# EAGLE board dw08aRev2 (EAGLE 6.6.0), part 1 of 3
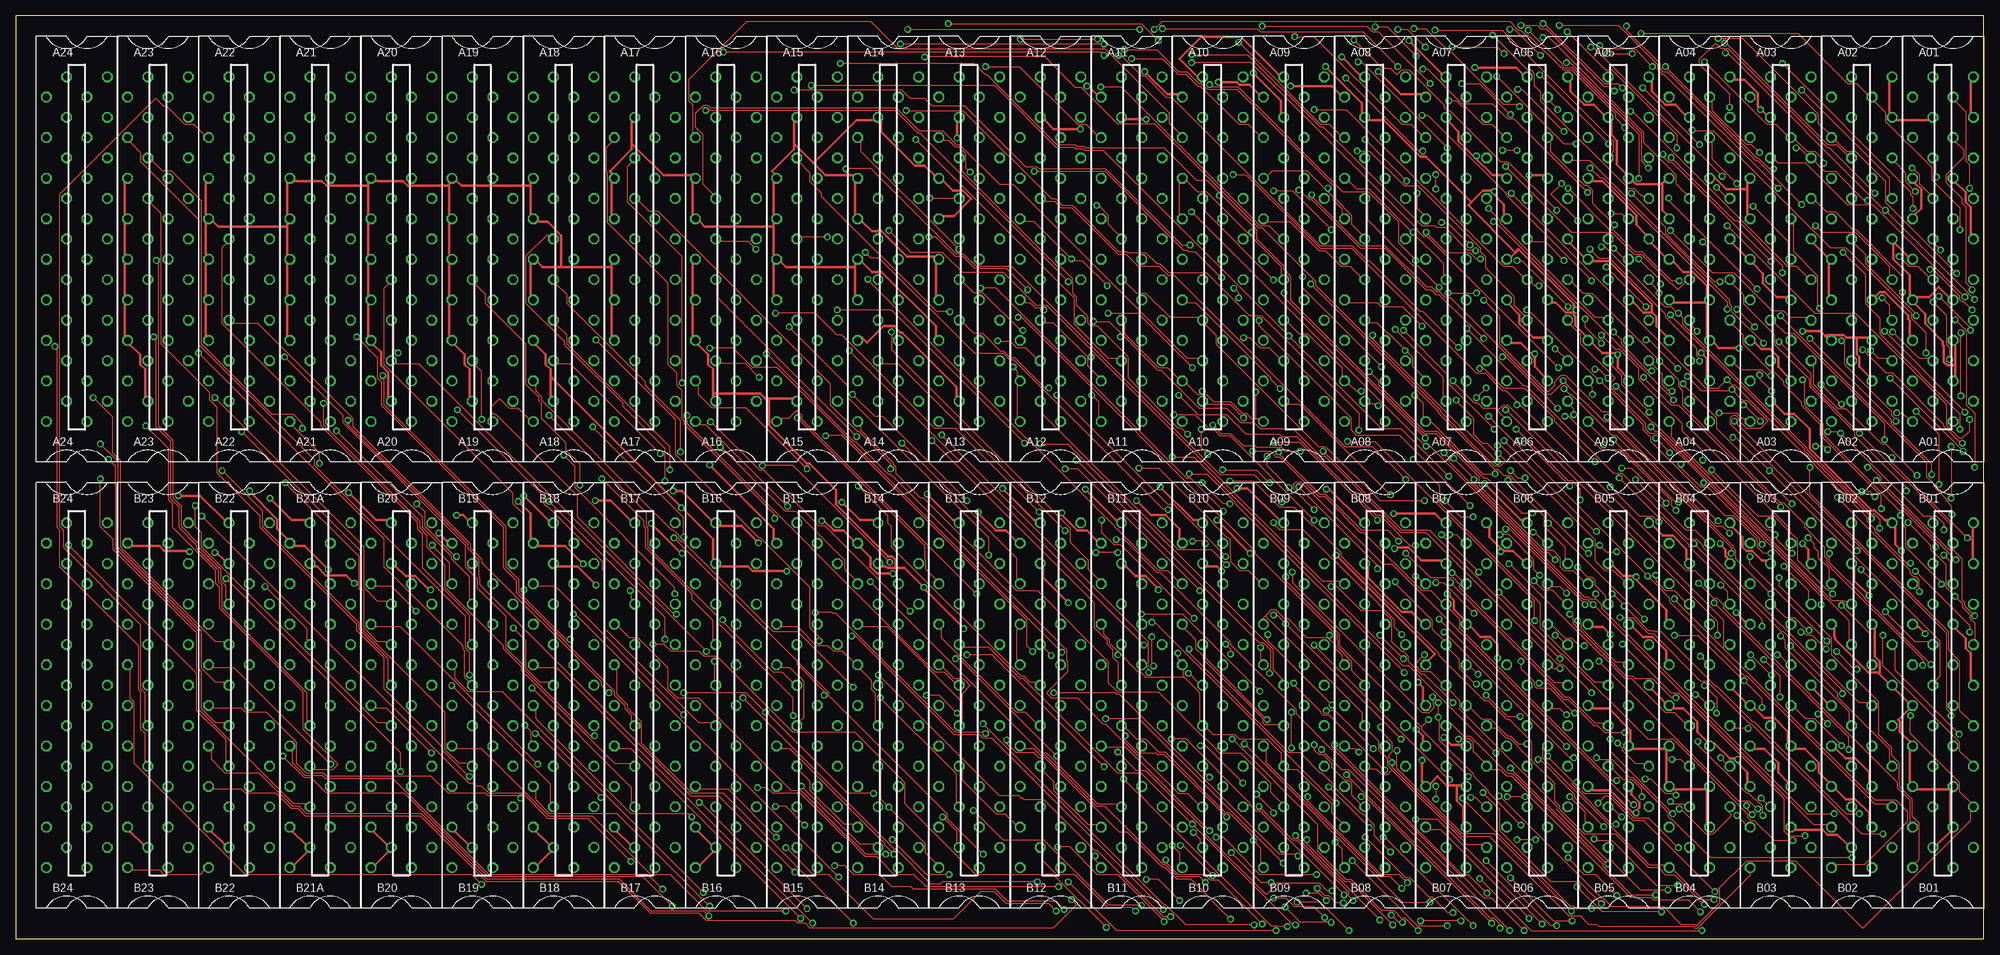
[diagram p6: board, top side]
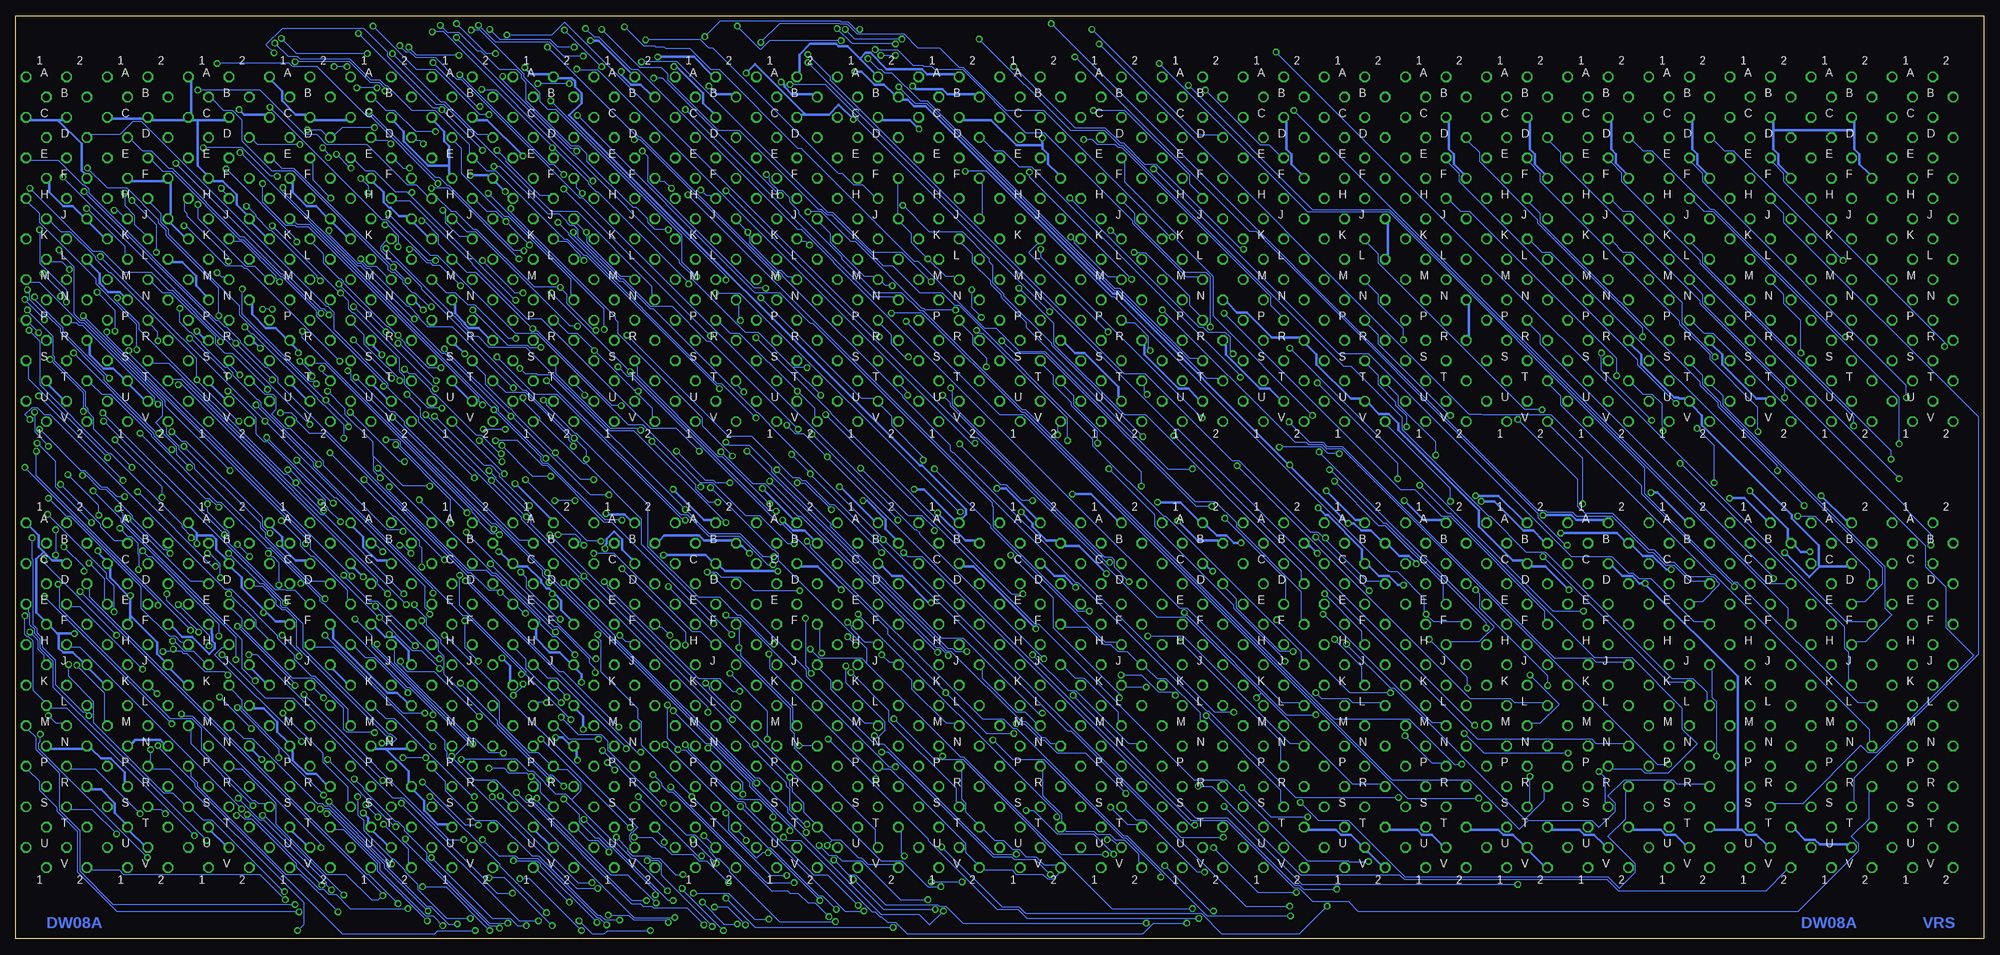
[diagram p7: board, bottom side, seen from below]

Size 307.98 x 144.46 mm. Coordinates in mm from the lower left corner, seen from the top.
Outline: 0,0 307.98,0 307.98,144.46 0,144.46 0,0
Copper layers (1*16): Top 0.035mm / dielectric 1.5mm / Bottom 0.035mm
Design rules "sierraproto": minimum track width 6mil, minimum drill 24mil, track to track 6mil, track to pad 6mil, pad to pad 10mil, via to via 6mil, smd to smd 6mil, copper to edge 25mil, drill to drill 10mil, minimum pad ring 10mil, minimum via ring 8mil, stop-mask expansion 0mil, vias tented up to drill 0mil, thermal gap 10mil
Net classes: 1 supply: width 0.381 mm

## Footprints (pad centres in the part's own frame; a part is rotated, then mirrored left to right if it is on the bottom)
H807 = drill 1.092 octagon: A1 4.763,28.575; A2 -1.587,28.575; B1 1.587,25.4; B2 -4.763,25.4; C1 4.763,22.225; C2 -1.587,22.225; D1 1.587,19.05; D2 -4.763,19.05; E1 4.763,15.875; E2 -1.587,15.875; F1 1.587,12.7; F2 -4.763,12.7; H1 4.763,9.525; H2 -1.587,9.525; J1 1.587,6.35; J2 -4.763,6.35; K1 4.763,3.175; K2 -1.587,3.175; L1 1.587,0; L2 -4.763,0; M1 4.763,-3.175; M2 -1.587,-3.175; N1 1.587,-6.35; N2 -4.763,-6.35; P1 4.763,-9.525; P2 -1.587,-9.525; R1 1.587,-12.7; R2 -4.763,-12.7; S1 4.763,-15.875; S2 -1.587,-15.875; T1 1.587,-19.05; T2 -4.763,-19.05; U1 4.763,-22.225; U2 -1.587,-22.225; V1 1.587,-25.4; V2 -4.763,-25.4

## Placement (x,y rotation side)
A01  M903  [H807]  301.62,106.36 0 top
A02  M903  [H807]  288.93,106.36 0 top
A03  M903  [H807]  276.23,106.36 0 top
A04  M903  [H807]  263.52,106.36 0 top
A05  M903  [H807]  250.82,106.36 0 top
A06  M907  [H807]  238.12,106.36 0 top
A07  M651  [H807]  225.43,106.36 0 top
A08  M651  [H807]  212.72,106.36 0 top
A09  M651  [H807]  200.03,106.36 0 top
A10  M651  [H807]  187.32,106.36 0 top
A11  M651  [H807]  174.62,106.36 0 top
A12  M651  [H807]  161.93,106.36 0 top
A13  W011  [H807]  149.22,106.36 0 top
A14  W011  [H807]  136.53,106.36 0 top
A15  W011  [H807]  123.83,106.36 0 top
A16  W011  [H807]  111.12,106.36 0 top
A17  W011  [H807]  98.42,106.36 0 top
A18  W011  [H807]  85.72,106.36 0 top
A19  W011  [H807]  73.03,106.36 0 top
A20  W011  [H807]  60.33,106.36 0 top
A21  W011  [H807]  47.62,106.36 0 top
A22  W011  [H807]  34.92,106.36 0 top
A23  W011  [H807]  22.23,106.36 0 top
A24  H807  [H807]  9.53,106.36 0 top
B01  M903  [H807]  301.62,36.51 0 top
B02  M903  [H807]  288.93,36.51 0 top
B03  M903  [H807]  276.23,36.51 0 top
B04  M903  [H807]  263.52,36.51 0 top
B05  M903  [H807]  250.82,36.51 0 top
B06  M101  [H807]  238.12,36.51 0 top
B07  M907  [H807]  225.43,36.51 0 top
B08  M651  [H807]  212.72,36.51 0 top
B09  M651  [H807]  200.03,36.51 0 top
B10  M651  [H807]  187.32,36.51 0 top
B11  M651  [H807]  174.62,36.51 0 top
B12  M651  [H807]  161.93,36.51 0 top
B13  M651  [H807]  149.22,36.51 0 top
B14  M651  [H807]  136.53,36.51 0 top
B15  M651  [H807]  123.83,36.51 0 top
B16  M517  [H807]  111.12,36.51 0 top
B17  M517  [H807]  98.42,36.51 0 top
B18  M517  [H807]  85.72,36.51 0 top
B19  M517  [H807]  73.03,36.51 0 top
B20  M517  [H807]  60.33,36.51 0 top
B21A  M517  [H807]  47.62,36.51 0 top
B22  M517  [H807]  34.92,36.51 0 top
B23  M517  [H807]  22.23,36.51 0 top
B24  H807  [H807]  9.53,36.51 0 top

## Tracks (layer width: path | path; a pad name or v marks a point on that pad's centre or on a via)
!I_MB03  (via drill 0.61)
  Top 0.152: v222.76,101.98 219.33,105.41 218.69,105.41 211.58,112.52 211.58,115.19 A08.H2 | v304.17,32 294.13,42.04 294.13,45.34 B02.H1 | v287.4,12.7 265.18,12.7 259.08,18.8 258.95,18.8 258.57,19.18 258.57,19.81 253.11,25.27 252.6,25.27 249.81,28.07 247.65,28.07 v247.4,28.32 | v243.84,28.32 243.21,28.32 v223.52,48.01 | v244.86,68.71 244.86,70.36 243.59,71.63 242.95,71.63 v234.82,79.76 | v231.39,79.76 224.16,87 224.16,88.27 v217.17,95.25 | v279.53,132.84 293.24,119.13 293.24,116.59 A02.H1
  Bottom 0.152: v304.17,32 304.17,30.86 304.42,30.61 304.42,29.72 v287.4,12.7 | v243.84,28.32 v247.4,28.32 | v223.52,48.01 223.65,48.01 232.79,57.15 233.3,57.15 v244.86,68.71 | v234.82,79.76 v231.39,79.76 | v217.17,95.25 217.55,95.25 221.74,99.44 221.74,100.84 222.5,101.6 v222.76,101.98 226.82,101.98 235.84,111 236.35,111 239.14,113.79 239.78,113.79 242.19,116.2 A06.H1 243.59,116.33 245.24,117.98 246.63,117.98 252.98,124.33 259.33,124.33 260.86,125.86 262.76,125.86 269.75,132.84 v279.53,132.84
!I_MB04  (via drill 0.61)
  Top 0.152: v213.23,83.44 212.98,83.69 211.84,83.69 A08.U2 | v227.08,95.5 235.97,86.61 236.35,86.61 250.06,72.9 251.33,72.9 261.62,62.61 263.02,62.61 264.03,61.59 264.03,61.34 288.42,36.96 289.81,36.96 B02.L1 | v296.93,114.3 296.93,116.2 296.55,116.59 296.55,116.97 v276.48,137.03 | v241.94,118.24 240.28,116.59 v244.47,112.39
  Bottom 0.152: v213.23,83.44 214.63,83.44 226.31,95.12 226.82,95.12 227.2,95.5 | 227.2,95.5 235.97,104.27 237.36,104.27 239.01,105.92 A06.L1 240.16,107.06 241.81,108.71 241.81,110.11 244.09,112.39 v244.47,112.39 | 227.2,95.5 v227.08,95.5 | v296.93,114.3 296.8,114.3 290.96,108.46 290.96,107.06 A02.L1 | v276.48,137.03 265.18,137.03 264.67,136.53 260.86,136.53 253.11,128.78 252.48,128.78 v241.94,118.24
!I_MB05  (via drill 0.61)
  Top 0.152: v277.75,45.85 285.12,38.48 285.12,37.85 293.24,29.72 293.24,27.69 B02.P1 | v282.57,52.32 282.57,53.59 264.16,72.01 | 264.16,72.01 257.05,79.12 255.78,79.12 255.14,79.76 255.14,80.64 249.68,86.11 249.68,87.12 250.32,87.76 244.98,93.09 244.98,94.49 243.33,96.14 A06.P1 | v292.1,100.33 293.24,99.19 293.24,97.54 A02.P1 | v264.16,71.37 264.16,72.01 | v194.56,96.77 194.56,96.01 209.04,81.53 209.04,79.63 209.8,78.87 216.53,78.87 v227.58,67.82 | v242.44,81.79 242.95,81.79 248.16,76.58 251.08,76.58 259.08,68.58 259.08,67.82 v259.84,67.06
  Bottom 0.152: v277.75,45.85 277.75,47.5 v282.57,52.32 | v292.1,100.33 292.1,99.69 288.67,96.27 288.67,95.38 265.94,72.64 265.43,72.64 v264.16,71.37 264.03,70.99 260.1,67.06 v259.84,67.06 | v194.56,96.77 194.82,97.03 194.82,99.31 A09.N2 | v227.58,67.82 227.71,67.82 232.28,72.39 232.28,72.77 233.55,74.04 234.7,74.04 v242.44,81.79
!I_MB06  (via drill 0.61)
  Top 0.152: v196.85,103.12 186.18,113.79 186.18,115.19 A10.H2 | v224.28,131.19 225.43,131.19 226.31,130.3 226.82,130.3 229.62,127.51 231.01,127.51 232.66,125.86 A06.D2 | v280.54,62.74 281.43,61.85 281.43,61.34 282.07,60.71 282.07,59.69 283.72,58.04 283.72,56.26 B02.D2 | v305.94,95.25 305.94,95.63 v300.99,100.58 | v303.78,104.14 292.61,115.32 292.61,118.62 287.91,123.32 286.51,123.32 284.86,124.97 A02.D2 283.72,126.11 282.07,127.76 282.07,129.16 270.26,140.97 v266.45,140.97 | v249.05,138.56 v252.98,138.56
  Bottom 0.152: v196.85,103.12 196.85,103.76 v224.28,131.19 | v280.54,62.74 280.54,62.99 282.07,64.52 282.07,64.9 293.24,76.07 293.62,76.07 304.29,86.74 304.29,93.6 v305.94,95.25 | v300.99,100.58 300.99,101.35 v303.78,104.14 | v249.05,138.56 241.43,130.94 240.79,130.94 235.71,125.86 234.06,125.86 A06.D2 | v252.98,138.56 264.03,138.56 v266.45,140.97
!I_MB07  (via drill 0.61)
  Top 0.152: v192.15,81.53 189.99,83.69 186.44,83.69 A10.U2 | v223.14,112.14 224.03,112.14 v227.58,108.58 | v255.91,80.14 256.54,79.5 257.18,79.5 286.89,49.78 286.89,46.74 B02.H2 | v231.27,112.27 231.52,112.27 v259.46,84.33
  Bottom 0.152: v192.15,81.53 197.49,86.87 198.12,86.87 221.49,110.24 221.49,110.49 v223.14,112.14 | v227.58,108.58 v231.27,112.27 232.79,113.79 234.19,113.79 235.84,115.44 A06.H2 | v255.91,80.14 255.91,80.64 259.59,84.33 | 259.59,84.33 272.92,97.66 272.92,99.06 284.1,110.24 284.1,111 285.24,112.14 285.24,113.54 286.89,115.19 A02.H2 | v259.46,84.33 259.59,84.33
!I_MB08  (via drill 0.61)
  Top 0.152: v276.23,47.37 276.86,46.74 276.86,45.59 286.89,35.56 286.89,34.04 B02.M2 | v288.16,60.71 268.22,80.64 268.22,81.41 268.73,81.92 269.24,81.92 269.75,81.41 269.75,81.03 270.89,79.88 273.05,79.88 274.19,81.03 270.89,84.33 270.26,84.33 v268.61,85.98 268.22,85.85 263.78,85.85 v261.62,88.01 | v203.2,129.79 208.28,129.79 232.79,105.28 234.19,105.28 235.84,103.63 A06.M2 237.24,102.74 237.74,102.23 v238.38,102.23 | v263.52,90.42 263.52,90.81 263.02,91.31 263.02,92.46 258.19,97.28 258.19,97.79 249.43,106.55 247.78,106.55 v246.38,107.95
  Bottom 0.152: v276.23,47.37 276.23,49.28 286.77,59.82 287.27,59.82 v288.16,60.71 | v268.61,85.98 268.61,86.11 274.07,91.57 275.21,91.57 276.73,93.09 276.73,94.23 283.59,101.09 284.99,101.09 286.64,102.74 A02.M2 | v203.2,129.79 173.86,100.46 170.56,100.46 A11.N2 | v261.62,88.01 261.62,88.52 v263.52,90.42 | v246.38,107.95 245.75,107.95 243.59,105.79 243.08,105.79 242.7,105.41 241.55,105.41 v238.38,102.23
!O_MB03  (via drill 0.61)
  Top 0.152: v127,109.86 122.94,109.86 A15.K2 | v191.39,140.34 204.22,127.51 205.61,127.51 207.26,125.86 A08.D2
  Bottom 0.152: v127,109.86 127.25,109.86 147.07,129.67 152.91,129.67 159.64,136.4 160.27,136.4 163.32,139.45 166.75,139.45 168.91,141.6 176.28,141.6 177.8,143.13 178.94,143.13 179.07,143.26 188.47,143.26 v191.39,140.34
!O_MB04  (via drill 0.61)
  Top 0.152: v189.99,68.07 188.98,68.07 v185.67,71.37 | v180.34,67.18 179.58,67.18 156.21,90.55 155.57,90.55 154.56,91.57 150.11,91.57 135.13,106.55 133.86,106.55 v132.97,107.44
  Bottom 0.152: v189.99,68.07 197.36,75.44 197.99,75.44 210.69,88.14 210.69,89.79 A08.S2 | v185.67,71.37 184.53,71.37 v180.34,67.18 | v132.97,107.44 131.19,107.44 124.33,100.58 124.33,99.19 122.68,97.54 A15.P2
!O_MB05  (via drill 0.61)
  Top 0.152: v169.8,133.35 172.97,133.35 194.69,111.63 196.09,111.63 197.74,109.98 A09.K2
  Bottom 0.152: v169.8,133.35 167.26,130.81 165.48,130.81 136.14,101.47 135.38,101.47 121.67,87.76 119.76,87.76 A15.T2
!O_MB06
  Top 0.152: A16.D2 105.92,126.11 105.92,130.56 105.28,131.19 105.28,134.49 114.43,143.64 133.73,143.64 138.05,139.32 170.43,139.32 180.47,129.29 180.47,127.76 182.12,126.11 A10.D2
!O_MB07
  Top 0.152: A10.S2 185.04,90.93 183.26,90.93 156.08,118.11 153.92,118.11 147.7,124.33 147.19,124.33 145.03,126.49 141.35,126.49 137.79,130.05 108.71,130.05 108.33,130.43 107.57,130.43 106.3,129.16 106.3,127.13 107.44,125.98 107.44,118.24 109.09,116.59 A16.H2
!O_MB08  (via drill 0.61)
  Top 0.152: v131.57,78.61 109.98,100.2 109.98,102.49 A16.M2 | v169.16,114.81 169.42,114.81 170.94,113.28 170.94,111.89 172.59,110.24 A11.K2
  Bottom 0.152: v131.57,78.61 145.92,92.96 145.92,93.22 153.42,100.71 153.42,100.97 155.07,102.62 155.07,105.41 155.57,105.92 155.57,106.43 159.77,110.62 164.97,110.62 v169.16,114.81
-15V  (via drill 0.61)
  Top 0.381: v126.11,65.41 126.49,65.41 128.02,63.88 129.54,63.88 131.06,62.36 B14.B2 132.21,61.21 133.73,59.69 133.73,58.17 134.75,57.15 v137.29,57.15 | v163.7,66.67 163.7,66.29 166.12,63.88 167.64,63.88 169.16,62.36 B11.B2 | v175.39,68.58 177.67,66.29 179.96,66.29 182.12,64.14 182.12,62.61 B10.B2 | v193.17,60.33 v187.96,65.53 | v150.62,66.8 150.62,66.67 153.42,63.88 154.94,63.88 156.46,62.36 B12.B2 | v167.64,133.48 167.89,133.48 169.16,132.21 A11.B2 | v176.66,135.76 180.21,132.21 181.86,132.21 A10.B2 | v199.52,133.48 205.99,133.48 207.26,132.21 A08.B2 | v213.23,135.76 216.79,132.21 219.96,132.21 A07.B2 | v188.21,134.11 191.13,134.11 191.52,133.73 193.04,133.73 194.56,132.21 A09.B2 | v88.77,58.67 85.98,61.47 81.66,61.47 B18.B2 80.52,62.61 80.52,66.55 v78.61,68.45 | v104.27,60.33 104.14,60.33 v99.44,65.02 | v27.18,60.58 27.05,60.71 23.24,60.71 22.48,61.47 18.16,61.47 B23.B2 | v48.9,57.78 45.21,61.47 43.56,61.47 B21A.B2 42.42,62.61 40.89,64.14 40.89,65.66 36.58,69.98 v36.58,70.1 | v66.17,63.5 67.31,62.36 67.56,62.36 B19.B2 | v108.58,74.17 118.62,64.14 118.62,62.61 B15.B2
  Bottom 0.381: v126.11,65.41 123.06,62.36 119.76,62.36 B15.B2 | v137.29,57.15 141.6,61.47 143.76,61.47 B13.B2 145.16,62.36 146.69,62.36 148.84,64.52 148.84,65.02 v150.62,66.8 | B08.B2 207.26,62.36 206.5,63.12 201.04,63.12 200.28,62.36 195.96,62.36 B09.B2 194.56,61.47 194.31,61.47 v193.17,60.33 | v163.7,66.67 159.38,62.36 157.86,62.36 B12.B2 | v175.39,68.58 174.75,68.58 171.83,65.66 171.83,64.14 170.31,62.61 B11.B2 | v187.96,65.53 186.31,63.88 184.53,63.88 B10.B2 | v167.64,133.48 167.13,132.97 162.94,132.97 162.18,132.21 157.86,132.21 A12.B2 | v176.66,135.76 175.64,135.76 173.61,133.73 172.09,133.73 170.56,132.21 A11.B2 169.16,131.32 168.4,131.32 167.39,130.3 165.61,130.3 136.27,100.97 135.51,100.97 108.65,74.11 | v199.52,133.48 198.25,132.21 195.96,132.21 A09.B2 | v213.23,135.76 213.23,135.25 211.71,133.73 210.19,133.73 208.66,132.21 A08.B2 | v188.21,134.11 187.71,133.6 187.71,133.35 186.56,132.21 183.26,132.21 A10.B2 | v88.77,58.67 88.77,58.8 89.92,59.94 91.44,59.94 92.96,61.47 B17.B2 94.36,62.36 95.89,63.88 97.41,63.88 98.55,65.02 v99.44,65.02 99.82,65.28 108.65,74.11 | v104.27,60.33 105.41,61.47 105.66,61.47 B16.B2 | v27.18,60.58 28.57,60.58 29.46,61.47 B22.B2 30.61,62.61 30.61,64.14 v36.58,70.1 | v48.9,57.78 49.66,57.78 51.82,59.94 53.34,59.94 54.86,61.47 B20.B2 56.26,62.36 57.4,63.5 v66.17,63.5 | v78.61,68.45 76.58,68.45 72.01,63.88 70.48,63.88 68.96,62.36 B19.B2 | v108.58,74.17 108.65,74.11
A06U1  (via drill 0.61)
  Top 0.152: 205.1,117.22 202.18,120.14 196.6,120.14 195.96,119.51 A09.F2 | 205.1,117.22 206.12,116.2 206.12,115.7 207.52,114.3 207.52,113.41 A08.J2 | v205.36,117.47 205.1,117.22 | 218.69,110.49 211.84,117.35 209.93,117.35 208.66,118.62 A08.F2 | 218.69,110.49 223.39,105.79 223.39,103.89 A07.M2 | v219.33,116.71 219.33,114.3 220.22,113.41 A07.J2 | A09.J2 195.96,112.27 199.39,112.27 203.96,107.7 204.98,107.7 207.39,105.28 208.79,105.28 210.44,103.63 A08.M2 | v218.69,110.62 218.69,110.49 | v233.55,71.75 239.14,66.17 239.14,64.64 242.44,61.34 242.44,59.44 B06.C1 | v243.84,82.04 243.84,82.93 243.33,83.44 A06.U1 | A12.J2 157.86,112.27 159.38,112.27 v165.23,106.43 165.61,106.17 166.88,106.17 v170.81,102.23 | A11.M2 173.74,102.74 175.39,101.09 176.78,101.09 180.59,97.28 185.04,97.28 A10.P2 186.18,96.14 187.83,94.49 187.83,93.09 203.84,77.09 204.98,77.09 213.49,68.58 v220.47,68.58 | A10.J2 182.12,113.41 182.12,118.36 A10.F2 183.26,118.62 184.91,116.97 186.31,116.97 193.04,110.24 | 193.04,110.24 197.99,105.28 197.99,103.89 A09.M2 | v228.09,66.04 226.19,66.04 v223.65,68.58 | 193.04,110.24 v193.42,110.62
  Bottom 0.152: v205.36,117.47 206.5,118.62 207.26,118.62 A08.F2 | A10.M2 186.44,103.63 187.2,103.63 188.21,104.65 188.85,104.65 193.17,108.97 193.17,110.36 v193.42,110.62 194.82,112.01 A09.J2 | 218.82,110.62 220.22,112.01 A07.J2 | 218.82,110.62 218.57,110.36 218.57,108.97 213.23,103.63 211.84,103.63 A08.M2 | v219.33,116.71 220.22,117.6 220.22,118.36 A07.F2 | 218.82,110.62 v218.69,110.62 | v243.84,82.04 v233.55,71.75 233.3,71.37 233.3,71.25 v228.09,66.04 | A12.J2 156.72,113.41 156.72,118.36 A12.F2 | A12.M2 161.04,103.63 162.43,103.63 v165.23,106.43 167.77,108.97 167.77,110.36 169.42,112.01 A11.J2 169.93,113.41 169.93,118.36 A11.F2 | A10.J2 182.12,112.01 180.47,110.36 180.47,108.97 175.13,103.63 173.74,103.63 A11.M2 172.34,102.74 171.83,102.23 v170.81,102.23 | v220.47,68.58 v223.65,68.58
A06V1  (via drill 0.61)
  Top 0.152: v218.95,85.09 220.22,83.82 220.22,81.66 A07.V2 221.36,81.03 229.62,72.77 v231.52,72.77 | 217.42,92.2 218.57,91.06 218.57,89.66 220.22,88.01 A07.T2 | 217.42,92.2 214.88,94.74 214.76,94.74 213.11,96.39 211.84,96.39 A08.P2 | v217.42,92.08 217.42,92.2 | A09.P2 199.14,96.39 200.79,94.74 202.18,94.74 207.52,89.41 207.52,88.01 A08.T2 208.66,86.87 209.8,85.72 v210.57,85.72 | A12.V2 156.72,81.66 156.72,86.61 A12.T2 156.72,88.01 156.72,88.9 v156.08,89.53 | v168.4,85.09 169.42,84.07 169.42,81.66 A11.V2 | 167.77,91.06 162.43,96.39 161.04,96.39 A12.P2 | 167.77,91.06 167.77,89.66 169.42,88.01 A11.T2 | 194.06,81.41 193.42,81.41 192.53,82.3 191.9,82.3 190.12,84.07 187.45,84.07 186.31,85.22 185.67,85.22 | 194.06,81.41 194.56,81.41 A09.V2 | 185.67,85.22 184.91,85.22 183.26,86.87 A10.T2 181.86,87.76 180.21,89.41 178.82,89.41 173.48,94.74 173.48,96.14 A11.P2 | 194.06,81.41 v194.06,85.6 | 167.77,91.06 v168.28,91.06 | 185.67,85.22 v185.67,85.72
  Bottom 0.152: 210.82,85.47 v217.42,92.08 220.09,94.74 221.49,94.74 223.14,96.39 A07.P2 | 210.82,85.47 208.41,83.06 208.41,81.66 A08.V2 | v218.95,85.09 218.95,85.34 220.22,86.61 A07.T2 | v231.52,72.77 A06.V1 | A10.V2 183.01,81.66 183.01,83.06 v185.67,85.72 194.69,94.74 196.09,94.74 197.74,96.39 A09.P2 | v168.4,85.09 168.4,85.6 169.42,86.61 A11.T2 | v156.08,89.53 156.08,90.93 158.24,93.09 158.24,94.49 159.89,96.14 A12.P2 | v194.06,85.6 194.82,86.36 194.82,86.61 A09.T2 | v168.28,91.06 168.91,91.06 170.94,93.09 170.94,94.49 172.59,96.14 A11.P2 | v210.57,85.72 210.82,85.47
B07U1  (via drill 0.61)
  Top 0.152: B14.M2 134.49,34.04 134.49,38.48 133.86,39.12 133.86,40.51 132.21,42.16 B14.J2 131.06,43.31 129.41,44.96 128.02,44.96 127.13,45.85 125.35,45.85 122.43,48.77 119.76,48.77 B15.F2 | B15.J2 119.76,42.42 121.16,42.42 123.32,40.26 123.32,34.67 122.68,34.04 B15.M2 | B12.J2 156.72,43.56 156.72,48.51 B12.F2 | 148.08,37.08 148.08,38.35 149.35,39.62 148.21,40.77 146.81,40.77 145.16,42.42 B13.J2 | 148.08,37.08 148.08,34.04 B13.M2 | 148.08,37.08 136.4,48.77 132.46,48.77 B14.F2 | 215.39,26.42 214.63,25.65 213.87,25.65 212.98,26.54 211.84,26.54 B08.P2 | 215.39,26.42 214.63,27.18 214.63,28.19 213.23,29.59 213.23,30.99 211.58,32.64 B08.M2 210.69,34.04 210.69,35.43 195.58,50.55 | 215.39,26.42 227.08,14.73 229.49,14.73 B07.U1 | B09.M2 197.74,33.53 195.45,33.53 195.07,33.91 195.07,34.54 185.8,43.81 185.8,44.32 184.66,45.47 184.66,46.86 183.01,48.51 B10.F2 | v206.5,15.11 207.52,14.1 207.52,11.81 B08.V2 | B08.T2 207.52,18.16 205.87,19.81 205.87,21.21 200.53,26.54 199.14,26.54 B09.P2 197.99,27.69 197.99,29.08 195.83,31.24 191.52,31.24 190.75,32 187.32,32 186.44,32.89 B10.M2 185.29,34.04 185.29,38.48 182.88,40.89 | v194.82,45.59 194.82,43.56 B09.J2 | 205.23,47.12 202.06,47.12 199.14,50.04 198.63,50.04 197.23,51.44 196.47,51.44 195.58,50.55 | 205.23,47.12 205.36,47.12 206.5,45.97 206.5,45.47 207.52,44.45 207.52,43.56 B08.J2 | 195.58,50.55 194.94,49.91 B09.F2 | v205.61,47.5 205.23,47.12 | B09.V2 194.82,11.81 194.82,14.22 v193.68,15.37 193.42,15.75 193.42,16.26 189.87,19.81 189.23,19.81 179.83,29.21 178.82,29.21 176.78,31.24 175.39,31.24 173.74,32.89 B11.M2
  Top 0.152: 182.88,40.89 182.75,41.02 182.75,42.16 B10.J2 182.12,43.56 181.86,43.81 v181.86,44.7 | 172.72,44.7 175.64,41.78 176.02,41.78 176.91,40.89 182.88,40.89 | 172.72,44.7 171.2,46.23 171.2,46.74 170.31,47.62 170.31,48.51 B11.F2 | 172.72,44.7 v172.47,44.45 | B13.F2 144.91,48.51 144.91,47.12 156.59,35.43 157.99,35.43 159.64,33.78 B12.M2
  Bottom 0.152: B15.M2 122.68,34.04 122.68,35.43 128.02,40.77 129.41,40.77 131.06,42.42 B14.J2 132.46,43.31 134.11,44.96 135.51,44.96 136.65,46.1 137.67,46.1 140.34,48.77 143.76,48.77 B13.F2 | B12.J2 156.72,42.16 156.72,40.77 151.38,35.43 149.99,35.43 148.34,33.78 B13.M2 | B14.M2 135.38,34.04 135.38,35.43 140.72,40.77 142.11,40.77 143.76,42.42 B13.J2 | v206.5,15.11 206.5,15.75 207.52,16.76 B08.T2 | B09.F2 194.82,48.51 v194.82,45.59 194.56,45.21 194.56,44.32 186.44,36.2 186.44,34.29 186.18,34.04 B10.M2 | v205.61,47.5 206.88,48.77 207.26,48.77 B08.F2 | B12.M2 161.04,33.78 162.43,33.78 167.77,39.12 167.77,40.51 169.42,42.16 B11.J2 170.56,43.31 171.32,43.31 v172.47,44.45 | v193.68,15.37 193.68,15.62 194.82,16.76 B09.T2 | B11.M2 173.74,33.78 175.13,33.78 180.47,39.12 180.47,40.51 182.12,42.16 B10.J2 | v181.86,44.7 182.12,44.96 182.12,48.51 B10.F2
B07V1  (via drill 0.61)
  Top 0.152: B14.T2 131.06,17.91 129.67,17.91 124.33,23.24 124.33,24.64 122.68,26.29 B15.P2 | B14.P2 135.38,26.29 135.38,21.84 v136.65,20.57 142.37,14.86 142.37,13.46 144.02,11.81 B13.V2 | B11.T2 169.16,17.91 167.77,17.91 162.43,23.24 162.43,24.64 160.78,26.29 B12.P2 | B13.P2 148.08,26.29 148.08,24.89 153.42,19.56 154.81,19.56 156.46,17.91 B12.T2 | v180.97,14.61 182.12,13.46 182.12,11.81 B10.V2 | v186.82,25.27 186.18,25.91 186.18,26.29 B10.P2 | v221.36,5.71 217.04,5.71 v192.28,30.48 | v168.91,12.95 168.91,12.32 169.42,11.81 B11.V2
  Bottom 0.152: B14.V2 132.21,11.81 132.21,13.21 134.37,15.37 135.76,15.37 136.65,16.26 138.68,16.26 139.19,16.76 143.51,16.76 143.76,17.02 B13.T2 144.27,18.16 144.27,19.43 147.19,22.35 147.19,26.29 B13.P2 | B12.P2 159.89,26.29 159.89,21.84 159.26,21.21 159.26,19.81 157.61,18.16 B12.T2 156.46,17.02 154.81,15.37 153.42,15.37 152.02,13.97 151,13.97 149.86,12.83 148.34,12.83 147.07,11.56 145.16,11.56 B13.V2 144.53,10.41 145.67,9.27 146.43,9.27 147.19,10.03 151.38,10.03 152.02,10.67 156.46,10.67 B12.V2 157.61,11.81 159.26,13.46 159.26,14.86 169.29,24.89 169.42,24.89 171.07,26.54 172.34,26.54 B11.P2 | v136.65,20.57 133.99,17.91 132.46,17.91 B14.T2 | 180.21,15.37 178.82,15.37 176.02,12.57 175.51,12.57 174.5,11.56 170.56,11.56 B11.V2 | 180.21,15.37 181.86,17.02 B10.T2 183.01,18.16 184.66,19.81 184.66,21.21 186.44,22.99 186.44,23.5 186.82,23.88 v186.82,25.27 187.2,25.53 192.15,30.48 v192.28,30.48 | 180.21,15.37 v180.97,14.61 | v221.36,5.71 226.31,10.67 B07.V1 | v168.91,12.95 169.42,13.46 169.42,16.76 B11.T2
GND  (via drill 0.61)
  Top 0.381: B16.V2 107.06,11.56 109.09,13.59 B16.U2 108.84,14.73 106.81,16.76 B16.T2 | B17.T2 94.11,16.76 96.14,14.73 B17.U2 | B18.V2 81.66,11.56 83.69,13.59 B18.U2 83.44,14.73 81.41,16.76 B18.T2 | B19.T2 68.71,16.76 70.74,14.73 B19.U2 | B20.V2 56.26,11.56 58.29,13.59 B20.U2 58.04,14.73 56.01,16.76 B20.T2 | B21A.V2 43.56,11.56 45.59,13.59 B21A.U2 45.34,14.73 43.31,16.76 B21A.T2 | B23.U2 19.94,14.73 17.91,16.76 B23.T2 | B22.T2 30.61,16.76 32.64,14.73 B22.U2 | 232.66,60.83 232.79,60.71 234.31,60.71 235.84,59.18 B06.C2 | 232.66,60.83 230.63,62.87 230.63,64.39 B07.A1 | B08.C2 211.58,58.04 211.58,56.52 216.92,51.18 218.44,51.18 219.96,49.66 B07.F2 | v215.77,61.09 215.9,61.21 217.93,61.21 219.96,59.18 223.14,59.18 B07.C2 | v232.41,60.58 232.66,60.83 | 225.55,24 226.31,24 B07.R1 | 225.55,24 223.9,24 222.5,25.4 221.36,24.26 B07.R2 220.22,24.51 220.09,24.64 v220.09,27.94 | v223.52,31.5 224.66,30.35 226.31,30.35 B07.N1 | B07.T1 226.57,18.16 226.57,20.57 225.55,21.59 225.55,24 | v219.46,40.13 220.22,39.37 220.22,37.21 B07.L2 | v231.9,43.94 231.9,46.1 230.76,47.24 229.24,47.24 227.71,48.77 B07.F1 226.69,49.91 225.04,51.56 225.04,52.96 v224.03,53.98 | v219.2,32.77 220.22,31.75 220.22,30.86 B07.N2 | v188.72,57.53 187.96,58.29 186.44,58.29 B10.C2 | v164.72,52.58 160.78,56.52 160.78,58.04 B12.C2 | v178.82,54.61 178.82,54.74 176.78,56.77 175.26,56.77 173.74,58.29 B11.C2 | v52.96,55.63 51.69,56.9 48.51,56.9 47.12,58.29 46.74,58.29 B21A.C2 | v64.9,54.61 64.64,54.61 62.48,56.77 60.96,56.77 59.44,58.29 B20.C2 | 137.67,58.04 139.06,58.04 v142.11,54.99 142.37,54.61 148.34,48.64 v148.34,48.51
  Top 0.381: 137.67,58.04 136.4,58.04 136.14,58.29 135.64,58.29 B14.C2 | A16.L2 105.92,105.66 105.92,100.71 A16.N2 105.92,99.31 105.92,94.36 A16.R2 106.81,92.96 108.33,91.44 108.33,89.92 109.09,89.15 109.09,85.34 | 109.09,85.34 109.09,84.84 A16.U2 | 117.86,84.58 117.22,84.58 116.46,85.34 109.09,85.34 | 117.86,84.58 121.54,84.58 A15.U2 | A13.U2 147.19,84.84 147.19,86.36 138.68,94.87 138.43,94.87 137.41,95.89 135.76,95.89 133.22,93.34 132.46,94.11 A14.R2 | 137.67,58.04 137.67,59.31 137.16,59.82 136.53,59.82 128.4,67.94 128.4,70.23 124.21,74.42 123.83,74.42 117.86,80.39 117.86,84.58 | v206.63,60.07 222.12,44.58 221.11,43.56 B07.J2 | B03.K1 281.43,38.99 283.46,36.96 B02.L2 | v290.07,53.72 287.78,56.01 287.78,58.04 B02.C2 | v295.15,60.71 294.13,61.72 294.13,64.39 B02.A1 292.99,65.53 292.48,65.53 290.96,67.06 290.45,67.06 280.8,76.71 280.8,79.76 278.38,82.17 276.86,82.17 275.34,83.69 A03.U2 | B01.C1 306.32,59.44 306.32,64.39 B01.A1 | v298.83,47.75 297.81,48.77 297.56,48.77 B01.F2 | B01.K1 305.94,40.39 305.94,44.7 305.18,45.47 305.18,46.99 303.66,48.51 B01.F1 | 291.59,41.53 292.99,40.13 B02.K1 294.13,38.99 296.16,36.96 B01.L2 294.64,34.29 294.89,34.04 294.89,32.38 296.42,30.86 B01.N2 296.42,29.46 296.42,24.51 B01.R2 297.56,23.37 302.51,23.37 B01.R1 302.77,23.11 302.77,18.16 B01.T1 302.77,16.76 300.74,14.73 B01.U2 | 291.59,41.53 291.46,41.66 289.94,41.66 284.73,46.86 284.73,47.12 284.61,47.24 284.61,48.51 B02.F2 | B02.R1 290.07,24.51 290.07,26.04 287.91,28.19 286.38,28.19 284.86,29.72 B02.N2 | B02.F1 290.96,48.51 290.96,44.2 291.72,43.43 291.72,41.66 291.59,41.53
  Top 0.381: v279.65,61.85 280.54,60.96 280.54,59.44 B03.C1 | v269.24,51.05 270.64,49.66 270.76,49.66 B03.F2 | v266.7,61.85 267.59,60.96 267.59,59.94 267.84,59.69 267.84,59.44 B04.C1 | 253.37,56.39 252.98,56.77 251.59,56.77 249.94,58.42 B05.C2 | 253.37,56.39 258.32,51.44 258.32,49.91 B04.F2 | 253.37,56.39 v253.62,56.64 | B04.C2 261.49,59.44 261.49,60.96 259.33,63.12 257.81,63.12 256.29,64.64 B05.A1 | B03.C2 273.94,59.18 273.3,59.18 271.78,60.71 270.89,60.71 270.26,61.34 270.26,62.87 268.73,64.39 B04.A1 | B05.K1 256.03,38.99 258.06,36.96 B04.L2 259.46,36.07 260.99,36.07 263.14,33.91 263.14,32.38 264.67,30.86 B04.N1 265.81,30.61 268.22,28.19 268.86,28.19 269.24,27.81 | v249.56,47.62 248.41,48.77 246.76,48.77 B05.F2 | B04.J2 258.32,43.56 258.32,45.09 256.16,47.24 254.63,47.24 253.11,48.77 B05.F1 | 253.49,19.81 253.24,19.56 249.56,23.24 246.89,23.24 246.76,23.37 B05.R2 | 253.49,19.81 254.13,20.45 254.13,21.34 252.86,22.61 252.86,23.11 B05.R1 | 253.49,19.81 v253.62,19.68 | B03.T1 278.51,17.02 282.83,17.02 283.59,16.26 285.12,16.26 286.64,14.73 B02.U2 | B03.N2 272.16,29.72 273.69,29.72 275.84,27.56 275.84,26.04 277.37,24.51 B03.R1 | B05.L2 246.76,36.07 249.3,36.07 252.73,32.64 252.73,30.86 B05.N1 253.11,29.72 258.06,29.72 B04.N2 258.32,29.46 258.32,24.51 B04.R2 259.46,23.37 264.41,23.37 B04.R1 264.67,23.11 264.67,18.16 B04.T1 | B04.K1 268.73,38.99 270.76,36.96 B03.L2 272.16,36.07 273.69,34.54 275.21,34.54 277.37,32.38 277.37,30.86 B03.N1 278.51,29.72 280.04,29.72 282.19,27.56 282.19,26.04 283.72,24.51 B02.R2 284.86,23.37 286.38,21.84 287.91,21.84 290.07,19.68 290.07,18.16 B02.T1
  Top 0.381: 269.24,27.81 271.02,26.04 271.02,24.51 B03.R2 | 269.24,27.81 v269.49,28.07 | A06.R1 239.01,94.11 237.49,94.11 235.33,96.27 235.33,97.66 233.68,99.31 A06.N2 | 237.49,91.31 237.74,91.06 237.74,89.53 239.27,88.01 A06.T1 | 237.49,91.31 235.59,93.22 234.06,93.22 A06.R2 | 237.49,91.31 v237.74,91.57 | 228.35,122.3 225.81,124.84 225.81,126.36 224.28,127.89 A07.C2 | 228.35,122.3 231.14,119.51 232.66,119.51 A06.F2 | 228.35,122.3 v228.6,122.56 | A05.T1 252.09,88.01 250.7,89.41 v250.7,91.44 250.32,91.69 248.28,91.69 246.76,93.22 A05.R2 245.75,94.36 244.09,96.01 244.09,97.41 243.84,97.66 243.84,98.04 | 234.7,107.44 235.2,107.95 243.84,99.31 243.84,98.42 | 234.7,107.44 234.06,106.81 A06.L2 | 243.84,98.42 243.84,98.04 | 243.84,98.42 v244.22,98.42 | 231.14,116.71 230.76,117.09 229.62,117.09 227.84,115.32 | 231.14,116.71 232.92,114.94 232.92,113.41 A06.J2 | 227.84,115.32 227.33,114.81 234.7,107.44 | 227.84,115.32 220.73,122.43 219.84,122.43 214.12,128.14 211.84,128.14 A08.C2 210.69,129.29 210.69,130.81 v204.98,136.53 | 231.14,116.71 v231.39,116.97 | A06.N1 240.41,99.57 241.05,99.57 242.57,98.04 243.84,98.04 | v279.65,95.12 282.45,95.12 283.21,94.36 | 283.21,94.36 283.46,94.11 A02.R2 | 288.16,94.11 286.51,94.11 286.13,94.49 283.34,94.49 283.21,94.36 | 288.16,94.11 289.81,94.11 A02.R1 | 288.16,94.11 288.16,91.44 288.54,91.06 288.54,89.53 290.07,88.01 A02.T1 | 303.53,89.79 303.53,88.01 A01.T1 | 303.53,89.79 303.53,92.96 A01.R1 | A01.N2 297.56,100.46 299.47,100.46 300.99,101.98 302.51,100.46 A01.N1 | A01.L2 296.16,106.81 294.13,108.84 A02.K1 293.88,108.84 293.88,106.43 296.42,103.89 296.42,100.71 A01.N2
  Top 0.381: A01.F2 297.31,118.36 297.31,118.24 298.2,117.35 298.2,114.3 297.31,113.41 A01.J2 | A01.K1 305.94,110.24 305.94,114.55 305.18,115.32 305.18,116.84 303.66,118.36 A01.F1 | 303.53,89.79 302.26,89.79 301.75,90.3 301.75,92.84 301.62,92.96 301.62,93.47 298.83,96.27 298.83,97.79 297.31,99.31 A01.N2 | A01.R2 296.42,94.36 296.42,96.77 296.16,97.03 296.16,97.54 292.48,101.22 291.72,101.22 A02.N1 | A01.C2 299.34,128.14 294.39,128.14 A02.C1 293.24,129.29 293.24,134.24 A02.A1 | A01.A1 305.94,134.24 305.94,129.29 A01.C1 | A05.A1 256.03,134.24 256.03,132.72 258.19,130.56 259.71,130.56 261.24,129.03 A04.C2 | A03.C2 273.94,129.03 273.18,129.79 v273.05,129.79 272.8,130.18 272.67,130.3 272.67,132.33 270.51,134.49 268.99,134.49 A04.A1 | A03.R2 272.16,93.22 272.29,93.22 273.18,92.33 274.57,92.33 275.84,91.06 275.84,89.53 277.37,88.01 A03.T1 | A04.N2 259.46,99.57 264.41,99.57 A04.N1 | A04.N1 264.67,99.31 264.67,94.36 A04.R1 265.81,93.22 266.57,92.46 v269.75,92.46 | v263.78,91.69 264.67,90.81 264.67,88.01 A04.T1 | A03.K1 281.43,108.84 283.46,106.81 A02.L2 283.72,105.66 283.72,100.71 A02.N2 | A04.K1 268.73,108.84 270.76,106.81 A03.L2 271.91,105.66 273.43,104.14 273.43,102.62 275.59,100.46 277.11,100.46 A03.N1 | 271.02,117.35 271.02,113.41 A03.J2 | 271.02,117.35 271.02,118.36 A03.F2 | A06.A1 243.33,134.24 243.33,132.72 245.49,130.56 247.01,130.56 248.54,129.03 A05.C2 249.68,127.89 249.68,125.86 250.57,124.97 250.57,121.16 251.97,119.76 A05.F1 253.11,118.62 253.62,118.11 257.56,118.11 | 256.03,98.04 256.16,98.04 256.79,97.41 256.79,95.89 258.32,94.36 A04.R2
  Top 0.381: 256.03,98.04 254.76,98.04 253.24,99.57 253.11,99.57 A05.N1 | A06.K1 243.33,108.84 245.36,106.81 A05.L2 246.76,106.05 249.3,106.05 256.03,99.31 256.03,98.04 | 257.56,118.11 258.06,118.62 A04.F2 | A05.F2 246.76,118.62 248.28,118.62 253.62,113.28 253.62,111.76 255.14,110.24 A05.K1 256.03,108.84 258.06,106.81 A04.L2 259.46,105.92 260.99,104.39 262.51,104.39 264.67,102.23 264.67,100.71 A04.N1 | 257.56,118.11 257.68,117.98 257.68,114.05 258.32,113.41 A04.J2 | 271.02,117.35 267.72,117.35 265.81,119.25 A04.F1 | v236.85,119.51 239.01,119.51 A06.F1 | A21.R2 42.42,94.36 42.42,99.31 A21.N2 42.42,100.71 42.42,105.66 A21.L2 42.42,107.06 42.42,111.51 | 42.42,111.51 42.42,112.01 A21.J2 42.42,113.41 42.42,118.36 A21.F2 43.56,118.62 47.88,118.62 48.64,117.86 55.12,117.86 | A22.R2 29.72,94.36 29.72,99.31 A22.N2 29.72,100.71 29.72,105.66 A22.L2 29.72,107.06 29.72,112.01 A22.J2 | A22.F2 29.72,118.36 29.72,113.41 A22.J2 | A23.U2 20.19,84.84 20.19,89.15 19.43,89.92 19.43,91.44 17.91,92.96 A23.R2 17.02,94.36 17.02,99.31 A23.N2 17.02,100.71 17.02,105.66 A23.L2 17.02,107.06 17.02,112.01 A23.J2 17.02,113.41 17.02,118.36 A23.F2 | 42.42,111.51 31.62,111.51 30.86,112.27 A22.J2 | v31.11,60.45 31.37,60.45 32.64,59.18 B22.C2 | A20.U2 58.29,84.84 58.29,88.65 57.15,89.79 57.15,91.82 56.01,92.96 A20.R2 55.12,94.36 55.12,99.31 A20.N2 55.12,100.71 55.12,105.66 A20.L2 55.12,107.06 55.12,112.01 A20.J2 55.12,113.41 55.12,117.86 | 55.12,117.86 55.12,118.36 A20.F2 56.26,118.62 60.58,118.62 61.34,117.86 67.82,117.86 | A13.J2 145.16,113.16 146.81,113.16 149.48,115.82 148.21,117.09 146.69,117.09 145.16,118.62 A13.F2 143.76,119.51 142.24,121.03 140.72,121.03 135.38,126.36 135.38,127.89 A14.C2 134.24,128.14 131.57,128.14 124.84,121.41
  Top 0.381: v147.32,125.35 147.32,127.89 A13.C2 | v166.62,126.75 162.43,126.75 161.04,128.14 A12.C2 | v176.91,128.27 173.74,128.27 A11.C2 | v193.68,135.51 197.99,131.19 197.99,129.29 A09.C2 | A13.N2 144.02,100.71 144.02,105.66 A13.L2 143.76,106.81 139.45,106.81 135.51,110.74 133.99,110.74 132.46,112.27 A14.J2 131.32,113.41 131.32,118.36 A14.F2 131.06,119.51 126.75,119.51 124.84,121.41 | 131.32,105.16 131.32,105.66 A14.L2 132.46,105.92 133.99,104.39 135.51,104.39 144.02,95.89 144.02,94.36 A13.R2 | 131.32,105.16 131.32,100.71 A14.N2 | A15.N2 118.62,100.71 118.62,105.66 A15.L2 | 118.62,111.51 118.62,107.06 A15.L2 | 118.62,111.51 118.62,112.01 A15.J2 118.62,113.41 118.62,118.36 A15.F2 118.75,119.76 118.36,120.14 121.79,123.57 121.79,124.33 | 121.79,124.33 121.79,127.89 A15.C2 | 131.32,105.16 120.52,105.16 119.76,105.92 A15.L2 | 124.84,121.41 121.92,124.33 121.79,124.33 | 80.52,117.86 80.52,118.36 A18.F2 | 80.52,117.86 80.52,113.41 A18.J2 81.66,112.27 83.19,112.27 85.34,110.11 85.34,105.16 | A19.U2 70.99,84.84 70.99,89.15 70.23,89.92 70.23,91.44 68.71,92.96 A19.R2 67.82,94.36 67.82,99.31 A19.N2 67.82,100.71 67.82,105.66 A19.L2 67.82,107.06 67.82,112.01 A19.J2 67.82,113.41 67.82,117.86 | 67.82,117.86 67.82,118.36 A19.F2 68.96,118.62 69.72,117.86 80.52,117.86 | A17.R2 93.22,94.36 93.22,99.31 A17.N2 93.22,100.71 93.22,105.16 | 93.22,105.16 93.22,105.66 A17.L2 | A17.J2 93.22,113.41 93.22,118.36 A17.F2 93.34,119.76 92.96,120.14 96.39,123.57 96.39,124.33 | 96.39,124.33 96.39,127.89 A17.C2 | 96.39,124.33 96.52,124.33 101.35,119.51 105.66,119.51 A16.F2 105.92,118.36 105.92,113.41 A16.J2 107.06,112.27 107.82,111.51 118.62,111.51
  Top 0.381: v90.81,55.37 87.88,58.29 84.84,58.29 B18.C2 | v120.65,57.53 115.32,57.53 114.55,58.29 110.24,58.29 B16.C2 109.09,59.44 109.09,62.61 104.2,67.5 | 83.69,87.88 83.69,89.15 82.93,89.92 82.93,91.44 81.41,92.96 A18.R2 | 83.69,87.88 83.69,84.84 A18.U2 | A18.N2 80.52,100.71 80.52,105.66 A18.L2 81.66,105.92 82.42,105.16 85.34,105.16 | 104.2,67.5 83.82,87.88 83.69,87.88 | 104.2,67.5 v104.14,67.44 | 93.22,105.16 85.34,105.16
  Bottom 0.381: B17.V2 94.36,11.56 96.39,13.59 B17.U2 97.54,14.73 99.06,16.26 100.58,16.26 101.35,17.02 105.66,17.02 B16.T2 | B19.V2 68.96,11.56 70.99,13.59 B19.U2 72.14,14.73 73.66,16.26 75.18,16.26 75.95,17.02 80.26,17.02 B18.T2 | B23.U2 21.34,14.73 25.65,14.73 26.42,15.49 27.94,15.49 29.46,17.02 B22.T2 | 38.48,17.02 37.85,17.02 37.08,16.26 35.56,16.26 34.04,14.73 B22.U2 | 38.48,17.02 42.16,17.02 B21A.T2 | B20.T2 54.86,17.02 50.55,17.02 49.78,16.26 48.26,16.26 46.74,14.73 B21A.U2 | B19.T2 67.56,17.02 63.25,17.02 62.48,16.26 60.96,16.26 59.44,14.73 B20.U2 | B17.T2 92.96,17.02 88.65,17.02 87.88,16.26 86.36,16.26 84.84,14.73 B18.U2 | v215.77,61.09 215.77,61.59 215.52,61.85 215.52,62.61 214.38,63.75 213.11,62.48 213.11,60.96 211.58,59.44 B08.C2 | 223.77,54.1 222.63,52.96 222.63,51.44 221.11,49.91 B07.F2 | 223.77,54.1 224.54,54.86 224.92,54.86 225.81,55.75 225.81,56.13 227.97,58.29 229.49,58.29 B07.C1 230.89,59.18 232.28,60.58 v232.41,60.58 | B07.U2 224.54,14.73 226.57,16.76 B07.T1 | v220.09,27.94 220.22,28.07 220.22,29.46 B07.N2 221.36,30.48 222.38,31.5 v223.52,31.5 | v219.46,40.13 219.46,41.4 220.22,42.16 B07.J2 221.36,43.31 222.88,44.83 224.41,44.83 226.57,46.99 226.57,48.51 B07.F1 | v231.9,43.94 230.63,42.67 230.63,40.39 B07.K1 | v219.2,32.77 219.2,34.8 220.22,35.81 B07.L2 | v224.03,53.98 223.9,53.98 223.77,54.1 | v188.72,57.53 196.98,57.53 197.74,58.29 B09.C2 199.14,59.18 200.03,60.07 v206.63,60.07 | v164.72,52.58 165.1,52.58 169.29,56.77 170.81,56.77 172.34,58.29 B11.C2 | v178.82,54.61 182.5,58.29 185.04,58.29 B10.C2 | B20.C2 58.04,58.29 56.52,56.77 54.99,56.77 53.85,55.63 v52.96,55.63 52.7,55.24 38.48,41.02 38.48,17.02
  Bottom 0.381: v64.9,54.61 68.58,58.29 70.74,58.29 B19.C2 72.14,59.18 73.66,59.18 78.99,64.52 78.99,67.06 91.57,79.63 91.57,80.64 93.09,82.17 94.61,82.17 96.14,83.69 A17.U2 97.54,84.58 99.06,84.58 104.39,89.92 104.39,91.44 105.92,92.96 A16.R2 107.06,94.11 111.38,94.11 115.32,98.04 116.84,98.04 118.36,99.57 A15.N2 | v142.11,54.99 143.89,56.77 145.41,56.77 146.94,58.29 B13.C2 | A15.R2 118.62,92.96 118.62,91.44 113.28,86.11 111.76,86.11 110.24,84.58 A16.U2 | A14.R2 131.32,92.96 131.32,91.44 125.98,86.11 124.46,86.11 122.94,84.58 A15.U2 | v148.34,48.51 158.12,58.29 159.64,58.29 B12.C2 | B03.K1 281.69,40.13 283.72,42.16 B02.J2 285.88,44.58 285.88,46.35 289.94,50.42 290.07,50.42 | 290.07,50.42 290.07,49.91 B02.F1 | 290.07,50.42 v290.07,53.72 290.45,53.72 293.24,56.52 293.24,58.04 B02.C1 294.13,59.44 295.15,60.45 v295.15,60.71 | 303.66,60.58 304.42,61.34 304.42,63.12 B01.A1 | 303.66,60.58 302.26,59.18 300.74,59.18 B01.C2 | 301.24,47.75 301.5,47.75 302.51,48.77 B01.F1 303.66,49.91 304.8,51.05 304.8,59.44 303.66,60.58 | 301.24,47.75 v298.83,47.75 | B03.F1 277.37,48.51 277.37,47.75 277.24,47.62 277.24,46.61 276.86,46.23 276.86,45.47 277.75,44.58 280.42,47.24 281.94,47.24 283.46,48.77 B02.F2 | B02.K1 294.39,40.13 296.42,42.16 B01.J2 297.56,43.31 299.08,44.83 300.61,44.83 301.24,45.47 301.24,47.75 | B02.N2 284.86,30.61 285.37,31.11 289.31,31.11 289.81,30.61 B02.N1 | B01.N1 302.51,29.72 297.56,29.72 B01.N2 296.16,29.72 294.64,28.19 293.12,28.19 290.96,26.04 290.96,24.51 B02.R1 | 279.65,63.12 279.65,63.5 280.54,64.39 B03.A1 | 279.65,63.12 v279.65,61.85 | 268.99,51.31 272.67,54.99 272.67,56.52 274.19,58.04 B03.C2 275.08,59.44 276.61,60.96 276.61,62.48 277.24,63.12 279.65,63.12
  Bottom 0.381: 268.99,51.31 267.33,49.66 265.81,49.66 B04.F1 | 268.99,51.31 v269.24,51.05 | 266.32,61.85 266.32,62.87 267.84,64.39 B04.A1 | 266.32,61.85 266.32,61.34 264.16,59.18 262.64,59.18 B04.C2 | 266.32,61.85 v266.7,61.85 | B05.C2 249.94,59.18 251.46,59.18 253.62,61.34 253.62,62.87 255.14,64.39 B05.A1 | v253.62,56.64 255.02,58.04 255.14,58.04 B05.C1 | B04.J2 258.32,42.16 256.29,40.13 B05.K1 | 249.56,47.24 250.19,47.24 251.71,48.77 B05.F1 | 249.56,47.24 248.67,47.24 246.51,45.09 246.51,43.56 B05.J2 | 249.56,47.24 v249.56,47.62 | B05.U2 249.94,14.73 251.97,16.76 B05.T1 252.86,18.16 252.86,18.92 v253.62,19.68 | B06.T1 240.41,17.91 241.94,17.91 244.09,20.07 244.09,21.59 245.62,23.11 B05.R2 246.51,24.51 246.51,26.16 249.94,29.59 249.94,29.72 | B03.U2 275.34,14.73 277.37,16.76 B03.T1 | B02.U2 288.04,14.73 290.07,16.76 B02.T1 290.96,18.16 292.48,19.68 292.48,21.21 294.64,23.37 296.16,23.37 B01.R2 | 249.94,29.72 251.71,29.72 B05.N1 | 249.94,29.72 246.76,29.72 B05.N2 | B03.J2 271.02,42.16 268.99,40.13 B04.K1 | B04.U2 262.64,14.73 264.67,16.76 B04.T1 | B04.R2 259.46,24.26 260.99,25.78 262.51,25.78 264.67,27.94 264.67,29.46 B04.N1 265.56,30.86 267.08,32.38 267.08,33.91 269.24,36.07 270.76,36.07 B03.L2 | v269.49,28.07 270.89,29.46 271.02,29.46 B03.N2 | B04.F2 258.32,48.51 258.32,46.99 249.81,38.48 248.28,38.48 246.76,36.96 B05.L2 | A06.U2 237.24,84.58 239.27,86.61 A06.T1 | A06.N1 239.27,99.31 239.27,97.92 237.74,96.39 237.74,96.27 237.11,95.63 235.59,95.63 234.06,94.11 A06.R2 | v237.74,91.57 239.14,92.96 239.27,92.96 A06.R1 | v228.6,122.56 234.19,128.14 235.84,128.14 A06.C2
  Bottom 0.381: A05.U2 249.94,84.58 251.97,86.61 A05.T1 | v250.7,91.44 251.97,92.71 251.97,92.96 A05.R1 | v244.22,98.42 245.36,99.57 A05.N2 | v231.39,116.97 232.79,118.36 232.92,118.36 A06.F2 234.06,119.51 v236.85,119.51 | v279.65,95.12 278.64,94.11 278.51,94.11 A03.R1 | A02.U2 288.04,84.58 290.07,86.61 A02.T1 291.21,87.76 292.74,89.28 294.26,89.28 296.42,91.44 296.42,92.96 A01.R2 | A01.U2 300.74,84.58 302.77,86.61 A01.T1 | A02.N1 291.72,101.22 293.5,101.22 294.89,102.62 294.89,104.14 296.42,105.66 A01.L2 | A02.K1 294.39,109.98 296.42,112.01 A01.J2 297.56,113.16 299.08,114.68 300.61,114.68 302.77,116.84 302.77,118.36 A01.F1 | 301.24,128.14 300.74,128.14 A01.C2 | 301.24,128.14 305.69,128.14 A01.C1 | A05.C1 256.29,128.14 261.24,128.14 A04.C2 262.64,129.03 264.16,129.03 266.32,131.19 266.32,132.72 267.84,134.24 A04.A1 | v273.05,129.79 272.29,129.03 268.99,129.03 A04.C1 | 279.53,128.14 275.34,128.14 A03.C2 | 279.53,128.14 280.29,128.14 A03.C1 | A03.C1 281.69,128.14 286.64,128.14 A02.C2 288.04,128.4 292.99,128.4 A02.C1 | A03.A1 280.54,134.24 280.54,129.29 A03.C1 | A03.U2 275.34,84.58 277.37,86.61 A03.T1 | A04.U2 262.64,84.58 264.67,86.61 A04.T1 | A03.N2 271.02,99.31 271.02,97.79 268.86,95.63 267.33,95.63 265.81,94.11 A04.R1 264.67,92.96 263.78,92.08 v263.78,91.69 | v269.75,92.46 270.51,93.22 270.76,93.22 A03.R2 | A03.K1 281.69,109.98 283.72,112.01 A02.J2 283.72,113.41 283.72,118.36 A02.F2 284.86,118.62 289.81,118.62 A02.F1 | A04.K1 268.99,109.98 271.02,112.01 A03.J2 271.91,113.41 273.43,114.94 273.43,116.46 275.59,118.62 277.11,118.62 A03.F1 278.26,119.76 279.53,121.03 279.53,128.14
  Bottom 0.381: 240.16,121.03 240.16,124.08 240.92,124.84 240.92,126.36 242.44,127.89 A06.C1 | 240.16,121.03 240.16,119.76 A06.F1 | 240.16,121.03 243.46,121.03 247.27,124.84 247.27,126.36 248.79,127.89 A05.C2 | A06.K1 243.59,109.98 245.62,112.01 A05.J2 246.76,113.16 248.03,113.16 249.3,114.43 249.56,114.43 250.44,115.32 250.44,116.84 251.97,118.36 A05.F1 | A05.K1 256.29,109.98 258.32,112.01 A04.J2 259.46,113.16 260.99,114.68 262.51,114.68 264.67,116.84 264.67,118.36 A04.F1 | A02.L2 283.46,105.92 281.94,105.92 279.78,103.76 279.78,102.23 278.26,100.71 A03.N1 | A01.F2 297.31,119.76 297.31,119.89 297.69,120.27 297.69,124.46 301.24,128.02 301.24,128.14 | A22.U2 34.04,84.58 35.56,84.58 40.89,89.92 40.89,91.44 42.42,92.96 A21.R2 | A21.C2 45.59,127.89 45.59,123.57 44.83,122.81 44.83,121.28 43.31,119.76 A21.F2 | 32.89,126.62 32.89,123.57 32.13,122.81 32.13,121.28 30.61,119.76 A22.F2 | 32.89,126.62 32.89,127.89 A22.C2 | 20.19,126.62 20.19,123.57 19.43,122.81 19.43,121.28 17.91,119.76 A23.F2 | 20.19,126.62 20.19,127.89 A23.C2 | 32.89,126.62 20.19,126.62 | 25.65,58.29 21.34,58.29 B23.C2 | 25.65,58.29 27.3,56.64 v31.11,60.45 | A20.R2 55.12,92.96 53.59,91.44 53.59,89.92 48.39,84.71 47.75,84.71 47.62,84.58 46.74,84.58 A21.U2 45.59,83.44 44.07,81.92 44.07,80.39 29.97,66.29 29.97,65.79 25.78,61.59 25.78,58.42 25.65,58.29 | A20.C2 58.29,127.89 58.29,123.57 57.53,122.81 57.53,121.41 55.88,119.76 A20.F2 | 147.32,124.21 147.32,123.7 146.43,122.81 146.43,121.28 144.91,119.76 A13.F2 | 147.32,124.21 v147.32,125.35 | A12.C2 159.64,128.14 155.32,128.14 151.38,124.21 147.32,124.21
  Bottom 0.381: v166.62,126.75 168.02,128.14 172.34,128.14 A11.C2 | 184.53,129.03 180.72,129.03 179.2,130.56 v176.91,128.27 | 184.53,129.03 185.04,129.03 A10.C2 | v193.68,135.51 192.28,136.91 184.53,129.16 184.53,129.03 | A14.U2 135.38,84.84 135.38,86.36 140.72,91.69 142.24,91.69 143.76,93.22 A13.R2 | A18.C2 83.69,127.89 83.69,123.57 82.93,122.81 82.93,121.28 81.41,119.76 A18.F2 | A19.C2 70.99,127.89 70.99,123.57 70.23,122.81 70.23,121.28 68.71,119.76 A19.F2 | A16.C2 109.09,127.89 109.09,123.57 108.33,122.81 108.33,121.28 106.81,119.76 A16.F2 | A17.J2 93.22,112.01 93.22,107.06 A17.L2 | v90.81,55.37 91.69,55.37 93.09,56.77 94.61,56.77 96.14,58.29 B17.C2 97.28,59.44 97.28,60.96 102.62,66.29 103,66.29 v104.14,67.44 | v120.65,57.53 120.78,57.53 121.54,58.29 B15.C2 | A18.N2 80.52,99.31 80.52,94.36 A18.R2 | v204.98,136.53 204.6,136.53 200.41,132.33 200.41,130.81 198.88,129.29 A09.C2
I_3CYCLE  (via drill 0.61)
  Top 0.152: v218.69,75.06 222.88,70.87 222.88,68.2 238.63,52.45 238.63,48.64 247.14,40.13 248.54,40.13 B05.K2 | v118.87,97.92 125.09,97.92 128.52,94.49 129.29,94.49 143.89,79.88 147.07,79.88 v160.15,66.8 | v198.5,101.09 198.5,100.46 v220.6,78.36
  Bottom 0.152: v218.69,75.06 218.69,76.45 v220.6,78.36 228.09,85.85 228.6,85.85 244.47,101.73 244.47,101.98 248.41,105.92 249.05,105.92 250.82,107.7 250.82,108.46 249.94,109.35 A05.K2 | v118.87,97.92 91.31,70.36 89.03,70.36 84.84,66.17 83.57,66.17 68.71,51.31 68.71,49.91 B19.F2 | v160.15,66.8 160.4,66.8 194.69,101.09 v198.5,101.09
I_AC00  (via drill 0.61)
  Top 0.152: v151,101.85 153.42,101.85 183.26,72.01 183.9,72.01 v188.98,66.93 | v224.16,101.09 v228.6,101.09 | v234.95,106.17 235.71,106.17 v242.95,98.93 | v265.43,73.41 272.67,66.17 275.21,66.17 277.37,64.01 277.37,62.61 B03.B1 | v260.22,68.33 259.84,68.33 v250.06,78.11 | v237.36,66.67 235.71,66.67 230.25,72.14 229.74,72.14 222.38,79.5 220.47,79.5 213.23,86.74 213.23,87.38 v211.84,88.77
  Bottom 0.152: v151,101.85 145.54,96.39 145.54,93.09 134.49,82.04 131.19,82.04 106.81,57.66 106.81,56.26 B16.D2 | v188.98,66.93 189.99,66.93 v211.84,88.77 v224.16,101.09 | v228.6,101.09 229.87,101.09 v234.95,106.17 | v242.95,98.93 243.33,98.93 245.49,101.09 245.87,101.09 247.4,102.62 247.4,103 248.67,104.27 249.17,104.27 249.68,104.78 249.68,105.28 264.54,120.14 267.84,120.14 272.54,124.84 272.54,128.14 274.07,129.67 275.46,129.67 277.11,131.32 A03.B1 | v265.43,73.41 265.05,73.41 263.4,71.75 263.4,71.5 v260.22,68.33 | v250.06,78.11 248.16,78.11 247.78,77.72 247.78,77.09 v237.36,66.67
I_AC01  (via drill 0.61)
  Top 0.152: v212.72,142.75 214.63,142.75 v219.2,138.18 | v235.59,143 238.12,143 238.63,142.49 239.52,142.49 248.54,133.48 249.43,133.48 v250.19,132.72 | v264.29,137.29 274.07,127.51 275.46,127.51 277.11,125.86 A03.D1 278.51,125.09 280.29,123.32 281.56,123.32 282.96,121.92 v282.96,121.41 | v290.45,65.79 290.45,65.91 279.91,76.45 279.91,76.71 v258.95,97.66
  Bottom 0.152: v212.72,142.75 209.68,139.7 207.9,139.7 207.77,139.57 206.5,139.57 206.25,139.32 202.44,139.32 199.14,136.02 197.87,136.02 185.55,123.7 185.04,123.7 167.39,106.05 166.75,106.05 156.34,95.63 154.56,95.63 150.88,91.95 146.94,91.95 123.44,68.45 120.27,68.45 116.97,65.15 116.97,64.52 106.81,54.36 106.81,49.91 B16.F2 | v219.2,138.18 222.25,138.18 224.41,140.34 232.92,140.34 v235.59,143 | v250.19,132.72 250.19,133.1 251.08,133.99 252.48,133.99 255.78,137.29 v264.29,137.29 | v290.45,65.79 280.67,56.01 278.51,56.01 B03.D1 | v258.95,97.66 258.95,97.79 259.84,98.68 260.22,98.68 v282.96,121.41
I_AC02  (via drill 0.61)
  Top 0.152: v216.28,142.37 217.81,142.37 v220.6,139.57 | v233.81,142.37 234.57,142.37 v238.63,138.3 | v246.51,139.57 246.89,139.57 v267.08,119.38 | v278.64,123.83 279.15,123.83 280.29,122.68 A03.E1 283.08,120.14 284.73,120.14 289.31,115.57 v289.81,115.57 | v276.73,58.29 280.54,54.48 280.54,53.09 B03.E1 | v288.93,69.98 290.19,69.98 v290.96,69.22 | v304.29,79.76 304.29,82.17 291.72,94.74 291.72,97.16 289.43,99.44 289.43,104.01 v286,107.44
  Bottom 0.152: v216.28,142.37 210.31,136.4 206.88,136.4 205.87,135.38 205.87,134.37 197.99,126.49 194.69,126.49 182.37,114.17 181.86,114.17 180.97,113.28 180.21,113.28 172.21,105.28 170.69,105.28 166.5,101.09 162.94,101.09 161.04,99.19 160.4,99.19 139.45,78.23 139.45,77.22 128.4,66.17 128.02,66.17 106.81,44.96 106.81,43.56 B16.J2 | v220.6,139.57 223.14,139.57 224.28,140.72 232.16,140.72 v233.81,142.37 | v238.63,138.3 245.24,138.3 v246.51,139.57 | v267.08,119.38 268.1,119.38 272.54,123.83 v278.64,123.83 | v276.73,58.29 277.24,58.29 v288.93,69.98 | v290.96,69.22 292.23,69.22 293.75,70.74 294.64,70.74 297.18,73.28 297.81,73.28 v304.29,79.76 | v286,107.44 286,111.76 v289.81,115.57
I_AC03  (via drill 0.61)
  Top 0.152: v218.82,142.49 220.73,142.49 224.41,138.81 224.66,138.81 232.79,130.68 234.95,130.68 v235.33,130.3 | v242.7,137.16 243.33,137.16 254.38,126.11 254.38,121.79 v255.52,120.65 | v257.81,122.81 257.81,122.43 258.7,121.54 259.21,121.54 v274.7,106.05 | v302.89,77.09 v302.89,68.96 | v305.05,82.42 305.05,82.55 v292.48,95.12 | v295.27,101.22 295.27,103.76 288.04,111 287.53,111 284.73,113.79 283.34,113.79 281.69,115.44 A03.H1
  Bottom 0.152: v218.82,142.49 217.42,141.1 216.66,141.1 211.58,136.02 210.57,136.02 185.55,111 185.04,111 180.09,106.05 180.09,105.92 134.11,59.94 133.99,59.94 125.86,51.82 124.71,51.82 109.86,36.96 107.06,36.96 B16.L2 | v235.33,130.3 235.84,130.3 v242.7,137.16 | v255.52,120.65 255.65,120.65 v257.81,122.81 | v274.7,106.05 274.7,106.68 281.18,113.16 281.18,113.54 281.56,113.92 281.56,115.32 A03.H1 | v302.89,68.96 300.1,66.17 299.47,66.17 288.42,55.12 288.42,51.82 283.97,47.37 283.08,47.37 282.19,46.48 281.69,46.48 B03.H1 | v302.89,77.09 302.89,77.22 305.05,79.38 v305.05,82.42 | v292.48,95.12 292.48,98.42 v295.27,101.22
I_AC04  (via drill 0.61)
  Top 0.152: v130.81,47.37 131.44,47.37 146.94,31.88 150.88,31.88 151.38,31.37 152.78,31.37 v179.58,4.57 | v206.38,30.35 206.38,30.1 226.44,10.03 227.33,10.03 v230.25,7.11 | v275.72,44.45 275.97,44.45 277.11,43.31 B03.J1 | v282.32,98.68 282.07,98.93 282.07,103.76 278.26,107.57 278.26,112.01 A03.J1 | v260.6,74.3 260.6,73.79 263.78,70.61 264.92,70.61 272.92,62.61 272.92,62.1 v273.3,61.72 | v271.4,59.82 271.4,58.67 v283.46,46.61
  Bottom 0.152: v130.81,47.37 125.35,47.37 108.58,30.61 107.06,30.61 B16.N2 | v179.58,4.57 181.74,6.73 182.37,6.73 189.87,14.22 190.25,14.22 v206.38,30.35 | v230.25,7.11 232.66,7.11 234.7,9.14 234.7,9.4 247.27,21.97 248.92,21.97 264.54,37.59 268.86,37.59 v275.72,44.45 | v282.32,98.68 282.32,96.52 280.67,94.87 280.54,94.87 278.89,93.22 278.89,93.09 275.21,89.41 274.83,89.41 273.94,88.52 273.94,88.14 270.13,84.33 270,84.33 269.62,83.95 269.62,83.31 v260.6,74.3 | v271.4,59.82 v273.3,61.72 | v283.46,46.61 283.21,46.61 281.56,44.96 280.16,44.96 278.51,43.31 B03.J1
I_AC05  (via drill 0.61)
  Top 0.152: v119,15.88 111.51,23.37 107.06,23.37 B16.R2 | v172.21,62.48 173.48,62.48 178.69,57.28 179.2,57.28 189.61,46.86 189.74,46.86 190.12,46.48 190.12,46.1 200.41,35.81 200.41,35.18 205.99,29.59 206.38,29.59 226.31,9.65 226.57,9.65 229.87,6.35 231.01,6.35 v236.09,1.27 | v285.75,30.23 281.56,34.42 280.16,34.42 278.51,36.07 B03.L1 | v271.91,114.68 277.37,109.22 277.37,107.06 A03.L1 | v260.35,103 259.08,103 254.51,107.57 253.37,107.57 249.94,111 249.43,111 v242.95,117.47 | v229.24,106.43 228.6,106.43 227.58,107.44 223.9,107.44 v220.73,110.62
  Bottom 0.152: v119,15.88 125.6,15.88 v172.21,62.48 172.47,62.87 189.99,80.39 189.99,80.52 191.77,82.3 191.9,82.3 208.15,98.55 208.66,98.55 212.98,102.87 213.49,102.87 220.73,110.11 v220.73,110.62 | v236.09,1.27 241.94,1.27 242.44,0.76 256.92,0.76 279.91,23.75 279.91,24.26 285.75,30.1 v285.75,30.23 | v271.91,114.68 271.78,114.68 270.38,113.28 270.38,113.03 268.22,110.87 267.97,110.87 260.86,103.76 260.86,103.5 v260.35,103 | v242.95,117.47 240.28,117.47 v229.24,106.43
I_AC06  (via drill 0.61)
  Top 0.152: v184.02,138.43 192.79,138.43 204.09,127.13 204.6,127.13 220.09,111.63 222.12,111.63 222.38,111.38 223.65,111.38 227.2,107.82 228.35,107.82 v228.47,107.7 | v252.73,129.54 252.98,129.54 277.24,105.28 278.64,105.28 280.29,103.63 A03.M1 | v270.89,20.83 270.89,20.32 v271.78,19.43 | v260.1,8.38 256.79,8.38 249.81,15.37 247.27,15.37 v247.01,15.62 | v232.28,1.65 232.28,2.29 231.39,3.17 230.76,3.17 v208.28,25.65 | v180.72,3.43 179.58,3.43 169.29,13.72 168.91,13.72 160.91,21.72 157.86,21.72 157.61,21.97 157.35,21.97 156.97,22.35 153.92,22.35 v135,41.27 | v126.49,38.1 126.49,38.73 122.3,42.93 122.3,43.43 v103,62.74